# Altium project PCB_Toto.PrjPCB
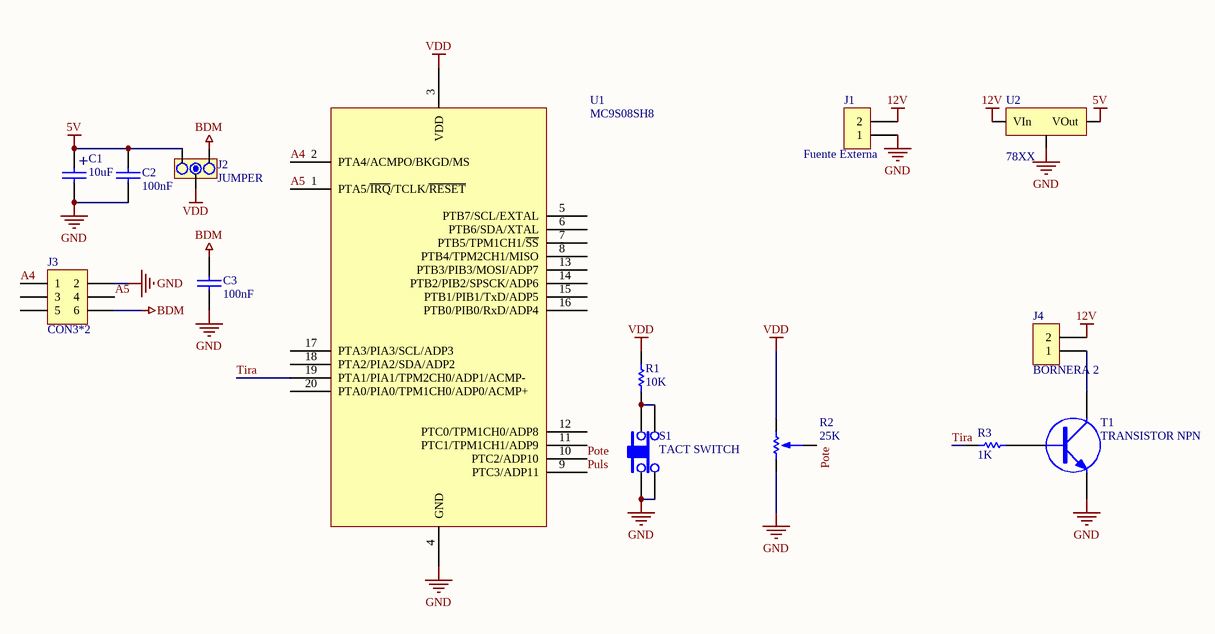
[diagram p0: PCB_Toto.SchDoc]
1 sheet, 14 parts. Net scope: global (net labels, ports and power ports of the same name join across sheets).
Board files: PCB_Toto.PcbDoc, PCB1.PcbDoc

## Sheet PCB_Toto.SchDoc
size A4

### Parts
C1  10uF  [CAP100RP]
C2  100nF  [0805]
C3  100nF  [0805]
J1  Fuente Externa  [BORNERA2]
J2  JUMPER  [JUMPER3]
J3  CON3*2  [SIP3*2]
J4  BORNERA 2  [BORNERA2]
R1  10K  [0805]
R2  25K  [POTENCIOMETRO]
R3  1K  [RES400]
S1  TACT SWITCH  [TACTSWITCH]
T1  TRANSISTOR NPN  [TO-220 V]
U1  MC9S08SH8  [DIP20]
U2  78XX  [DPAK]

### Nets
5V: C1.1 C2.1 J2.1 U2.3(VOut)
12V: J1.2 J4.2 U2.1(VIn)
BDM: C3.1 J2.3 J3.6
GND: C1.2 C2.2 C3.2 J1.1 J3.2 R2.3 S1.1 S1.2 T1.3(E) U1.4(GND) U2.2(GND)
VDD: J2.2 R1.2 R2.1 U1.3(VDD)
A4: J3.1 U1.2(PTA4/ACMPO/BKGD/MS)
A5: J3.4 U1.1(PTA5/~{IRQ}/TCLK/~{RESET})
Pote: R2.2 U1.10(PTC2/ADP10)
Puls: U1.9(PTC3/ADP11)
Tira: R3.1 U1.19(PTA1/PIA1/TPM2CH0/ADP1/ACMP-)
NetJ4_1: J4.1 T1.2(C)
NetR1_1: R1.1 S1.3 S1.4
NetR3_2: R3.2 T1.1(B)

Not connected (* = marked no-connect by the designer): J3 3 5; U1 5(PTB7/SCL/EXTAL) 6(PTB6/SDA/XTAL) 7(PTB5/TPM1CH1/~{SS}) 8(PTB4/TPM2CH1/MISO) 11(PTC1/TPM1CH1/ADP9) 12(PTC0/TPM1CH0/ADP8) 13(PTB3/PIB3/MOSI/ADP7) 14(PTB2/PIB2/SPSCK/ADP6) 15(PTB1/PIB1/TxD/ADP5) 16(PTB0/PIB0/RxD/ADP4) 17(PTA3/PIA3/SCL/ADP3) 18(PTA2/PIA2/SDA/ADP2) 20(PTA0/PIA0/TPM1CH0/ADP0/ACMP+)

### Notes on the sheet
- (in symbol CAPPOL) +

### Library data of the parts
C1 = CAPPOL
C2 C3 = CAP
J1 = BORNERA 2
J2 = JUMPER3
J3 = PIN3*2
R1 R3 = RES
R2 = POTENCIOMETRO
U1 = MC9S08SH8: IC MCU 8BIT 8K FLASH 20-DIP
U2 = 78XX: REGULDOR POSITIVO